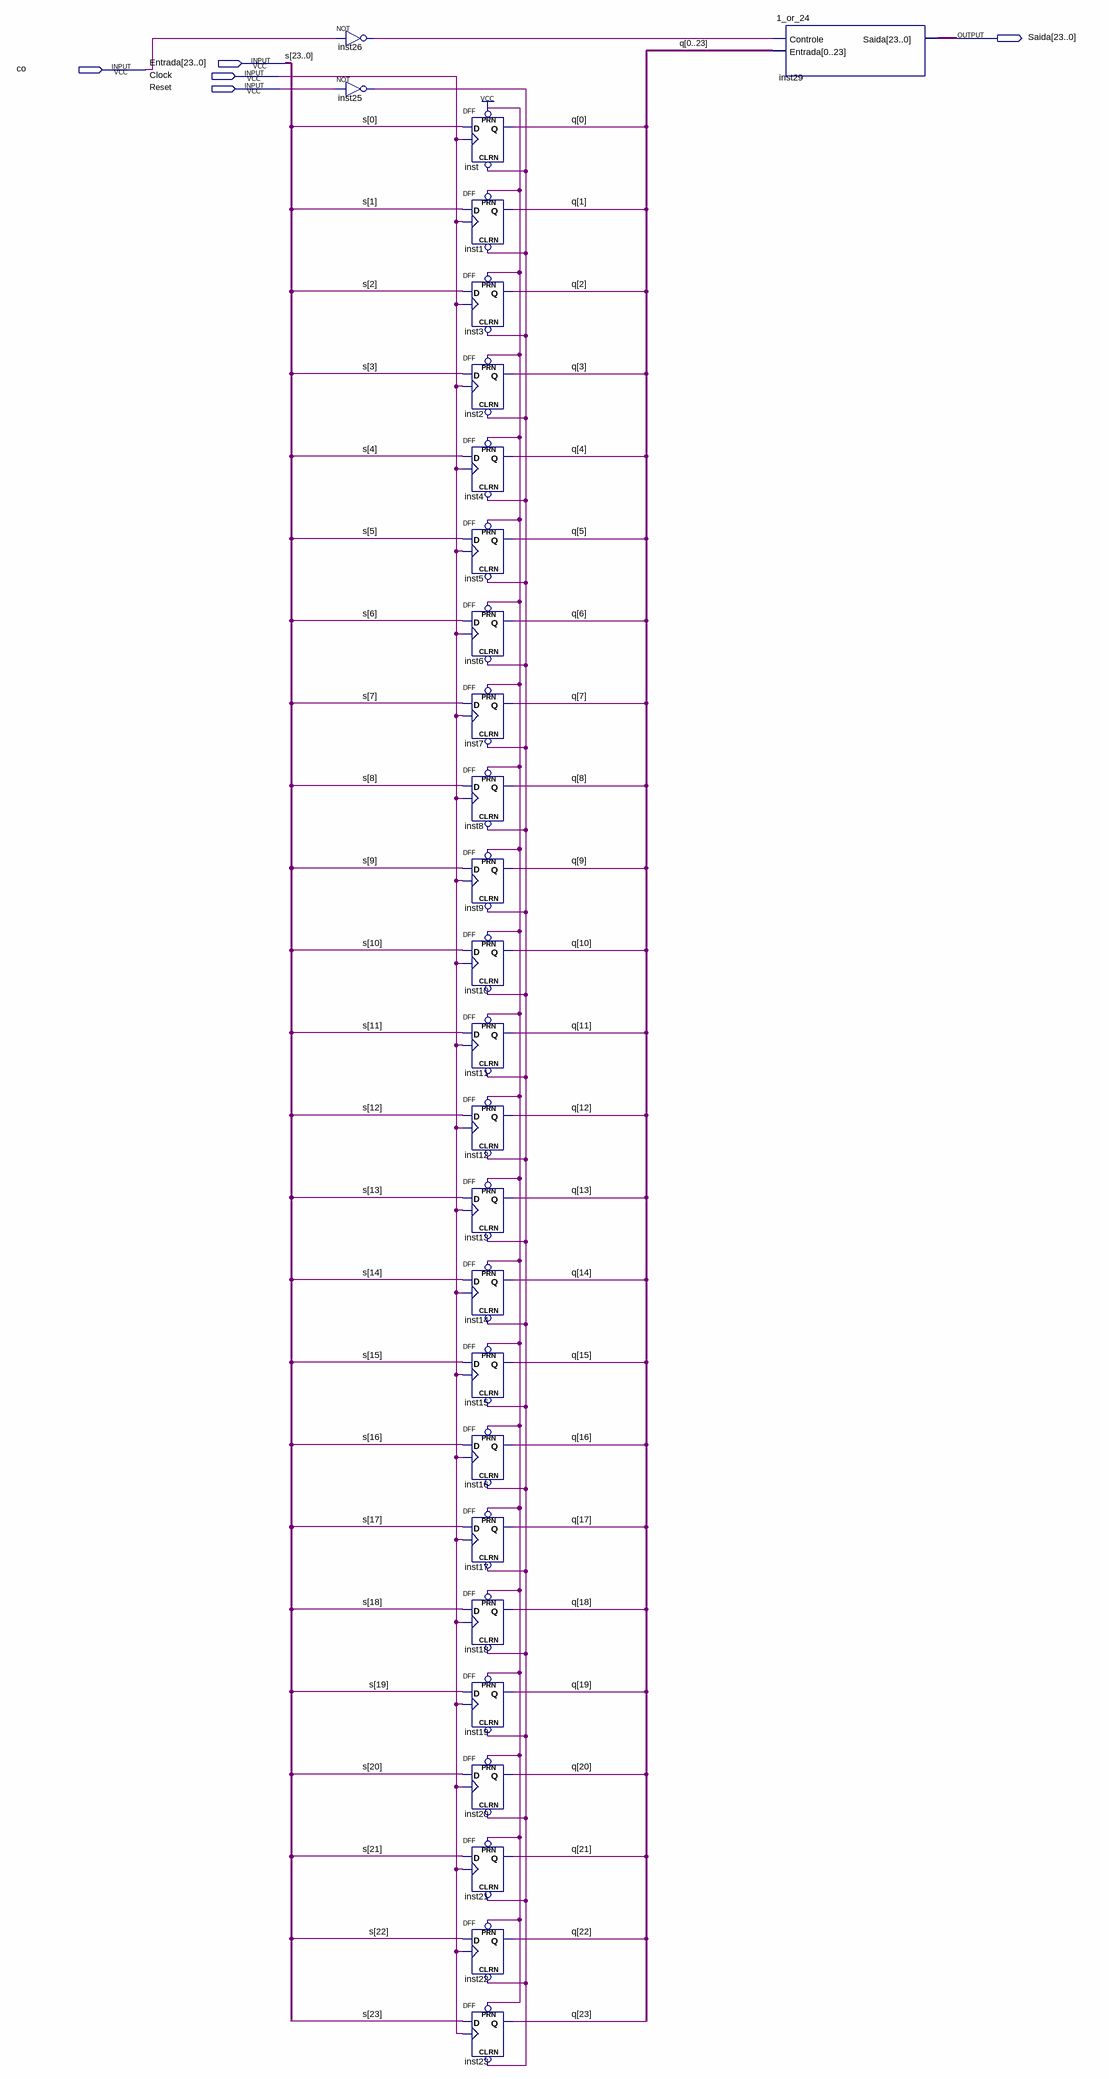
[diagram p0: schematic sheet]
// Quartus schematic dff_24.bdf as structural Verilog: 27 symbols, 5 pins
module dff_24 (
  input  [23:0] Entrada,
  input  co,
  input  Clock,
  input  Reset,
  output [23:0] Saida
);

  wire inst25_out, inst26_out;
  wire [23:0] q;

  not inst26 (inst26_out, co);
  not inst25 (inst25_out, Reset);
  DFF inst (.CLRN(inst25_out), .CLK(Clock), .D(Entrada[0]), .PRN(1'b1), .Q(q[0]));
  DFF inst1 (.CLRN(inst25_out), .CLK(Clock), .D(Entrada[1]), .PRN(1'b1), .Q(q[1]));
  DFF inst3 (.CLRN(inst25_out), .CLK(Clock), .D(Entrada[2]), .PRN(1'b1), .Q(q[2]));
  DFF inst2 (.CLRN(inst25_out), .CLK(Clock), .D(Entrada[3]), .PRN(1'b1), .Q(q[3]));
  DFF inst4 (.CLRN(inst25_out), .CLK(Clock), .D(Entrada[4]), .PRN(1'b1), .Q(q[4]));
  DFF inst5 (.CLRN(inst25_out), .CLK(Clock), .D(Entrada[5]), .PRN(1'b1), .Q(q[5]));
  DFF inst6 (.CLRN(inst25_out), .CLK(Clock), .D(Entrada[6]), .PRN(1'b1), .Q(q[6]));
  DFF inst7 (.CLRN(inst25_out), .CLK(Clock), .D(Entrada[7]), .PRN(1'b1), .Q(q[7]));
  DFF inst8 (.CLRN(inst25_out), .CLK(Clock), .D(Entrada[8]), .PRN(1'b1), .Q(q[8]));
  DFF inst9 (.CLRN(inst25_out), .CLK(Clock), .D(Entrada[9]), .PRN(1'b1), .Q(q[9]));
  DFF inst10 (.CLRN(inst25_out), .CLK(Clock), .D(Entrada[10]), .PRN(1'b1), .Q(q[10]));
  DFF inst11 (.CLRN(inst25_out), .CLK(Clock), .D(Entrada[11]), .PRN(1'b1), .Q(q[11]));
  DFF inst12 (.CLRN(inst25_out), .CLK(Clock), .D(Entrada[12]), .PRN(1'b1), .Q(q[12]));
  DFF inst13 (.CLRN(inst25_out), .CLK(Clock), .D(Entrada[13]), .PRN(1'b1), .Q(q[13]));
  DFF inst14 (.CLRN(inst25_out), .CLK(Clock), .D(Entrada[14]), .PRN(1'b1), .Q(q[14]));
  DFF inst15 (.CLRN(inst25_out), .CLK(Clock), .D(Entrada[15]), .PRN(1'b1), .Q(q[15]));
  DFF inst16 (.CLRN(inst25_out), .CLK(Clock), .D(Entrada[16]), .PRN(1'b1), .Q(q[16]));
  DFF inst17 (.CLRN(inst25_out), .CLK(Clock), .D(Entrada[17]), .PRN(1'b1), .Q(q[17]));
  DFF inst18 (.CLRN(inst25_out), .CLK(Clock), .D(Entrada[18]), .PRN(1'b1), .Q(q[18]));
  DFF inst19 (.CLRN(inst25_out), .CLK(Clock), .D(Entrada[19]), .PRN(1'b1), .Q(q[19]));
  DFF inst20 (.CLRN(inst25_out), .CLK(Clock), .D(Entrada[20]), .PRN(1'b1), .Q(q[20]));
  DFF inst21 (.CLRN(inst25_out), .CLK(Clock), .D(Entrada[21]), .PRN(1'b1), .Q(q[21]));
  DFF inst22 (.CLRN(inst25_out), .CLK(Clock), .D(Entrada[22]), .PRN(1'b1), .Q(q[22]));
  DFF inst23 (.CLRN(inst25_out), .CLK(Clock), .D(Entrada[23]), .PRN(1'b1), .Q(q[23]));
  \1_or_24  inst29 (
    .Controle(inst26_out),
    .Entrada({q[0], q[1], q[2], q[3], q[4], q[5], q[6], q[7], q[8], q[9], q[10], q[11], q[12], q[13], q[14], q[15], q[16], q[17], q[18], q[19], q[20], q[21], q[22], q[23]}),
    .Saida(Saida));

  // Other names for the same wires on the sheet: s[23:0] = Entrada
endmodule
